# Altium schematic sheet DB10011_USBToSerial.SchDoc
size A4; Engineer: Danny Bokma; Revision: V0.3; SheetNumber: 5; SheetTotal: 7
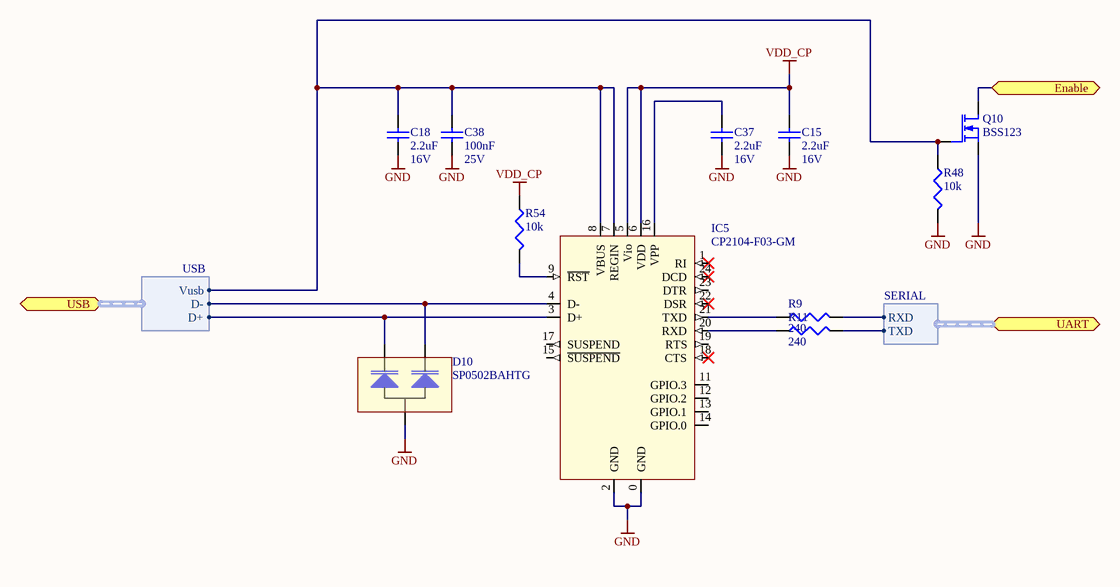
[diagram p0: DB10011_USBToSerial.SchDoc]

## Parts
C15  2.2uF  Voltage Rating: 16V  [C0603]
C18  2.2uF  Voltage Rating: 16V  [C0603]
C37  2.2uF  Voltage Rating: 16V  [C0603]
C38  100nF  Voltage Rating: 25V  [C0402]
D10  SP0502BAHTG  [SOT23]
IC5  CP2104-F03-GM  [QFN24]
Q10  BSS123  [SOT-23]
R9  240  [0402]
R11  240  [0402]
R48  10k  [0402]
R54  10k  [0402]

## Ports
Enable, UART (harness SERIAL), USB (harness USB)

## Harnesses
USB: Vusb, D+, D-
SERIAL: RXD, TXD

## Nets
GND: C15.1 C18.1 C37.1 C38.1 D10.A IC5.0(GND) IC5.2(GND) Q10.S R48.1
VDD_CP: C15.2 IC5.5(Vio) IC5.6(VDD) R54.2
Enable: Q10.D ; port Enable
NetC18_2: C18.2 C38.2 IC5.7(REGIN) IC5.8(VBUS) Q10.G R48.2 ; port USB.Vusb
NetC37_2: C37.2 IC5.16(VPP)
NetD10_K1: D10.K1 IC5.4(D-) ; port USB.D-
NetD10_K2: D10.K2 IC5.3(D+) ; port USB.D+
NetIC5_9: IC5.9(~{RST}) R54.1
NetIC5_20: IC5.20(RXD) R11.2
NetIC5_21: IC5.21(TXD) R9.2
NetR9_1: R9.1 ; port UART.RXD
NetR11_1: R11.1 ; port UART.TXD

Not connected (* = marked no-connect by the designer): IC5 1(RI)* 11(GPIO.3) 12(GPIO.2) 13(GPIO.1) 14(GPIO.0) 15(~{SUSPEND}) 17(SUSPEND) 18(CTS)* 19(RTS) 22(DSR)* 23(DTR) 24(DCD)*

## Notes on the sheet
- Title
- Size:
- Date:
- A4
- Number:
- Time:
- Revision:
- Sheet
- of
- File:

## Library data of the parts
C15 C18 C37 = 2.2uF/0603/CER/16V: Capacitor, 2.2uF, 16V, X5R; Capacitance Tolerance: +/- 10%; Capacitor Case Style: 0603; Brand Number: GRM188R61C225KE15D; Brand: MURATA; Dielectric Characteristic: X5R; Capacitance: 2.2uF; Temperature Range: -55°C to 85°C; Price: 0,077; Order Code Supplier: 1735526; Supplier: Farnell
C38 = 100nF/0402/CER/25V: Capacitor, 100nF, 25V, X7R; Capacitance Tolerance: 10nF; Capacitor Case Style: 0402; Brand Number: GRM155R71E104KE14D; Brand: MULTICOMP; Dielectric Characteristic: X7R; Capacitance: 100nF; Temperature Range: -55 to +125 C; Price: 0,0225; Order Code Supplier: 2456106; Supplier: Farnell
D10 = SP0502BAHTG: Diode TVS Dual, Vrwm: 5.5V Vc: 8V; Brand: LITTLEFUSE; Case Style: SOT-23; Brand Number: SP0502BAHTG; Clamping Voltage: 8V; Order Code Supplier: 1827631; Price: 0,80; Supplier: Farnell; Temperature Range: -40°C to +125°C; Vrwm: 5.5V
IC5 = CP2104-F03-GM: USB to UART converter; Brand: Silicon Labs; Case Style: QFN24; Price: 1,65; Order Code Supplier: 757-4983; Brand Number: CP2104-F03-GM; Supplier: RS-Components
Q10 = BSS123: Mosfet, N-channel, Vds:100V, Id:0.15A, Vgs-th:2.8V, Rds-on:3.5ohm; Brand: NXP; Drain Current: 0.15A; Drain Source Voltage: 100V; Gate Source Voltage: 20V; On Resistance: 3.5ohm; Threshold Voltage: 2.8V; Brand Number: BSS123; Case Style: SOT-23; Order Code Supplier: 1510764; Price: 0,082; Supplier: Farnell; Temperature Range: -55°C to +150°C; Transistor Polarity: N-channel
R9 R11 = 240/0402/0063W/50V: Resistor, 240, 0.1%, 0.0625W, 50V, 100PPM, 0402; Brand: VISHAY DRALORIC; Brand Number: CRCW0402240RFKED; Power Rating: 0.063W; Case Style: 0402; Order Code Supplier: 2121522; Price: 0,0006; Resistance: 240; Supplier: Farnell; Temperature Coefficient: ± 100PPM; Temperature Range: -55°C to +125°C; Voltage Rating: 50V
R48 R54 = 10k/0402/0063W/50V: Resistor, 10k, 0.1%, 0.0625W, 50V, 100PPM, 0402; Brand: VISHAY DRALORIC; Brand Number: CRCW040210K0FKED; Power Rating: 0.063W; Case Style: 0402; Order Code Supplier: 2121730; Price: 0,0005; Resistance: 10k; Supplier: Farnell; Temperature Coefficient: ± 100PPM; Temperature Range: -55°C to +125°C; Voltage Rating: 50V